# Altium schematic sheet LTEWatch.SchDoc: LTEWatch
size A4; Author: Tristan Traiber; DrawnBy: Tristan Traiber; Engineer: Tristan Traiber; Organization: MSE HES-SO; Address1: HEVS; Address3: Tristan Traiber; DocumentNumber: 1; Revision: 1.0; SheetNumber: 1; SheetTotal: 6
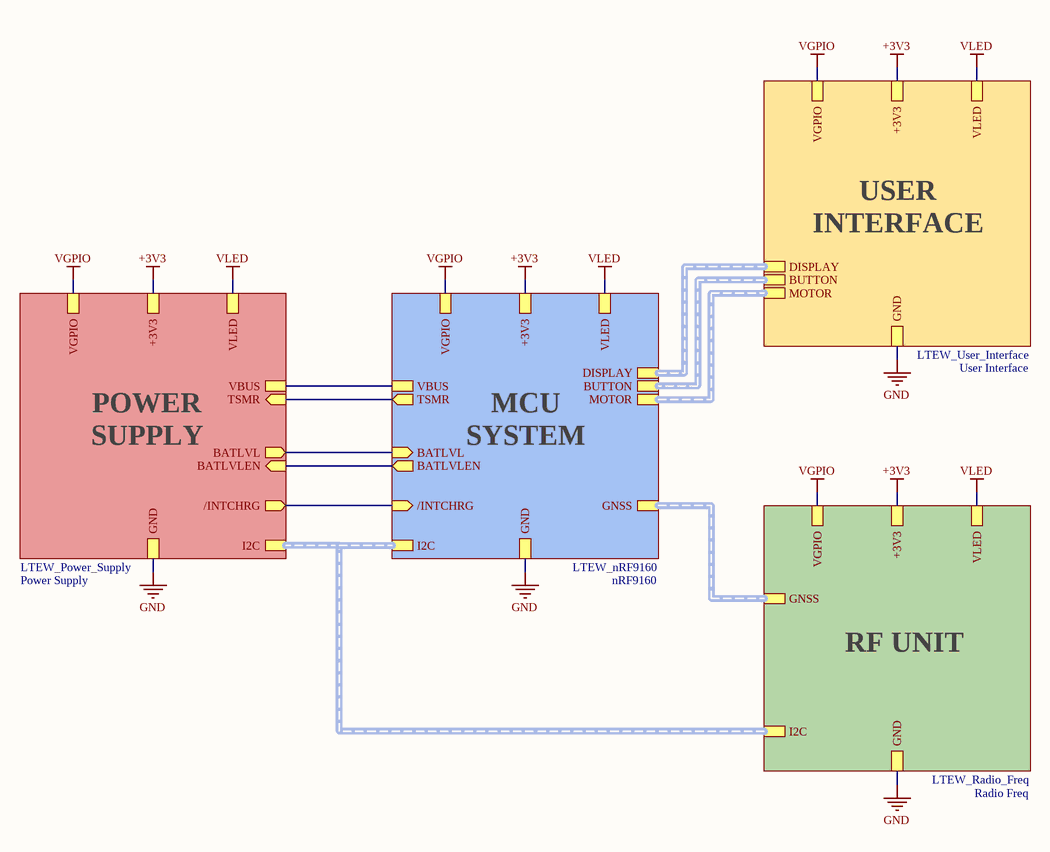
[diagram p0: LTEWatch.SchDoc]

## Sub-sheets
nRF9160 = LTEW_nRF9160: TSMR (out), BATLVL (in), +3V3, GND, BATLVLEN (out), VGPIO, /INTCHRG (in), VLED, DISPLAY (harness DISPLAY), BUTTON (harness BTN_BUS), GNSS (harness GNSS), I2C (harness I2C), VBUS, MOTOR (harness MOTOR)
Power Supply = LTEW_Power_Supply: /INTCHRG (out), +3V3, TSMR (in), GND, BATLVLEN (in), VGPIO, VLED, BATLVL (out), I2C (harness I2C), VBUS
Radio Freq = LTEW_Radio_Freq: GND, VGPIO, +3V3, VLED, GNSS (harness GNSS), I2C (harness I2C)
User Interface = LTEW_User_Interface: GND, VGPIO, +3V3, VLED, DISPLAY (harness DISPLAY), BUTTON (harness BTN_BUS), MOTOR (harness LED_BUS)

## Nets
+3V3: sheet Power Supply/+3V3, sheet nRF9160/+3V3, sheet User Interface/+3V3, sheet Radio Freq/+3V3
GND: sheet Power Supply/GND, sheet nRF9160/GND, sheet User Interface/GND, sheet Radio Freq/GND
VGPIO: sheet Power Supply/VGPIO, sheet nRF9160/VGPIO, sheet User Interface/VGPIO, sheet Radio Freq/VGPIO
VLED: sheet Power Supply/VLED, sheet nRF9160/VLED, sheet User Interface/VLED, sheet Radio Freq/VLED
(unnamed): sheet Power Supply//INTCHRG, sheet nRF9160//INTCHRG
(unnamed): sheet Power Supply/TSMR, sheet nRF9160/TSMR
(unnamed): sheet Power Supply/BATLVLEN, sheet nRF9160/BATLVLEN
(unnamed): sheet Power Supply/BATLVL, sheet nRF9160/BATLVL
(unnamed): sheet Power Supply/VBUS, sheet nRF9160/VBUS

## Buses and harness runs
harness sheet nRF9160/BUTTON = sheet User Interface/BUTTON
harness sheet nRF9160/DISPLAY = sheet User Interface/DISPLAY
harness sheet nRF9160/GNSS = sheet Radio Freq/GNSS
harness sheet nRF9160/I2C = sheet Power Supply/I2C = sheet Radio Freq/I2C
harness sheet nRF9160/MOTOR = sheet User Interface/MOTOR

## Notes on the sheet
- USER INTERFACE
- POWER SUPPLY
- MCU SYSTEM
- RF UNIT
- Title
- Size:
- Date:
- A4
- Number:
- Time:
- Revision:
- Sheet
- of
- File: